# Altium schematic sheet biolab_rev2.SchDoc
size A; SheetNumber: 1; SheetTotal: 1
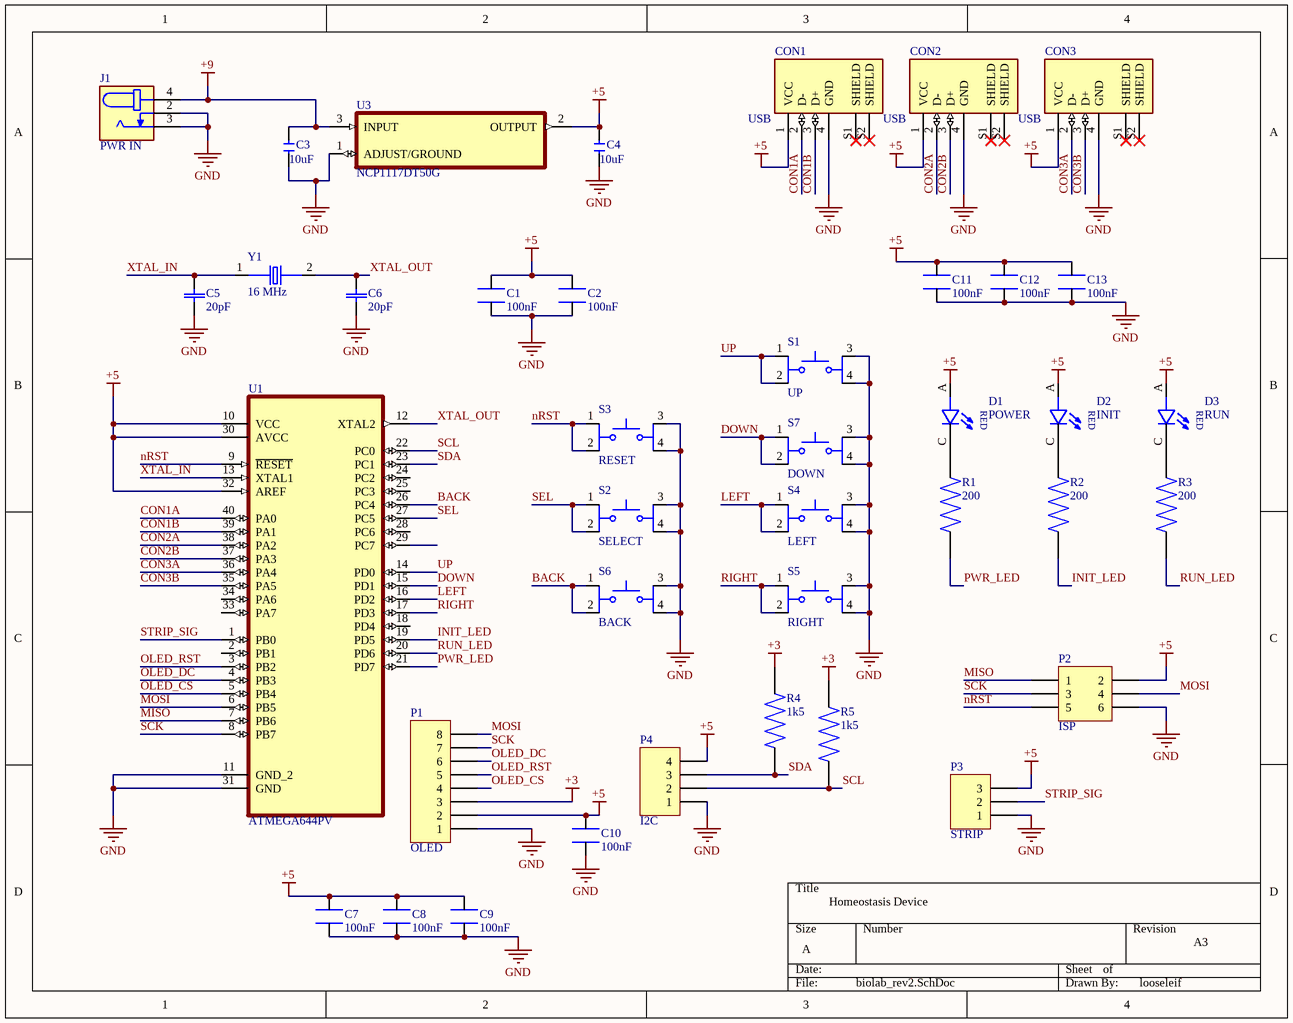
[diagram p0: biolab_rev2.SchDoc]

## Parts
C1  100nF  [WCAP-CSST_885382206004]
C2  100nF  [WCAP-CSST_885382206004]
C3  10uF  [C0603]
C4  10uF  [C0603]
C5  20pF  [CAPC1608X85N]
C6  20pF  [CAPC1608X85N]
C7  100nF  [WCAP-CSST_885382206004]
C8  100nF  [WCAP-CSST_885382206004]
C9  100nF  [WCAP-CSST_885382206004]
C10  100nF  [WCAP-CSST_885382206004]
C11  100nF  [WCAP-CSST_885382206004]
C12  100nF  [WCAP-CSST_885382206004]
C13  100nF  [WCAP-CSST_885382206004]
CON1  USB  [GCT_USB1130-15-A_REVA]
CON2  USB  [GCT_USB1130-15-A_REVA]
CON3  USB  [GCT_USB1130-15-A_REVA]
D1  POWER  [LED_7012X1]
D2  INIT  [LED_7012X1]
D3  RUN  [LED_7012X1]
J1  PWR IN  [NINIGI_DC-005]
P1  OLED  [HDR1X8]
P2  ISP  [HDR2X3]
P3  STRIP  [HDR1X3H]
P4  I2C  [HDR1X4H]
R1  200  [RESC1608X55N]
R2  200  [RESC1608X55N]
R3  200  [RESC1608X55N]
R4  1k5  [RESC1508X55N]
R5  1k5  [RESC1508X55N]
S1  UP  [SW_TL3301AF160QG]
S2  SELECT  [SW_TL3301AF160QG]
S3  RESET  [SW_TL3301AF160QG]
S4  LEFT  [SW_TL3301AF160QG]
S5  RIGHT  [SW_TL3301AF160QG]
S6  BACK  [SW_TL3301AF160QG]
S7  DOWN  [SW_TL3301AF160QG]
U1  ATMEGA644PV  [DIP254P1524X483-40]
U3  NCP1117DT50G  [DPAK229P990X238-4N]
Y1  16 MHz  [XTAL_FOXSDLF/160-20]

## Nets
+3: P1.3 R4.2 R5.2
+5: C1.2 C2.2 C4.2 C7.2 C8.2 C9.2 C10.2 C11.2 C12.2 C13.2 CON1.1(VCC) CON2.1(VCC) CON3.1(VCC) D1.A D2.A D3.A P1.2 P2.2 P3.3 P4.4 U1.10(VCC) U1.30(AVCC) U1.32(AREF) U3.2(OUTPUT)
+9: C3.2 J1.4 U3.3(INPUT)
GND: C1.1 C2.1 C3.1 C4.1 C5.1(C1) C6.1(C1) C7.1 C8.1 C9.1 C10.1 C11.1 C12.1 C13.1 CON1.4(GND) CON2.4(GND) CON3.4(GND) J1.2 J1.3 P1.1 P2.6 P3.1 P4.1 S1.3 S1.4 S2.3 S2.4 S3.3 S3.4 S4.3 S4.4 S5.3 S5.4 S6.3 S6.4 S7.3 S7.4 U1.11(GND_2) U1.31(GND) U3.1(ADJUST/GROUND)
BACK: S6.1 S6.2 U1.26(PC4)
CON1A: CON1.2(D-) U1.40(PA0)
CON1B: CON1.3(D+) U1.39(PA1)
CON2A: CON2.2(D-) U1.38(PA2)
CON2B: CON2.3(D+) U1.37(PA3)
CON3A: CON3.2(D-) U1.36(PA4)
CON3B: CON3.3(D+) U1.35(PA5)
DOWN: S7.1 S7.2 U1.15(PD1)
INIT_LED: R2.1 U1.19(PD5)
LEFT: S4.1 S4.2 U1.16(PD2)
MISO: P2.1 U1.7(PB6)
MOSI: P1.8 P2.4 U1.6(PB5)
nRST: P2.5 S3.1 S3.2 U1.9(~{RESET})
OLED_CS: P1.4 U1.5(PB4)
OLED_DC: P1.6 U1.4(PB3)
OLED_RST: P1.5 U1.3(PB2)
PWR_LED: R1.1 U1.21(PD7)
RIGHT: S5.1 S5.2 U1.17(PD3)
RUN_LED: R3.1 U1.20(PD6)
SCK: P1.7 P2.3 U1.8(PB7)
SCL: P4.2 R5.1 U1.22(PC0)
SDA: P4.3 R4.1 U1.23(PC1)
SEL: S2.1 S2.2 U1.27(PC5)
STRIP_SIG: P3.2 U1.1(PB0)
UP: S1.1 S1.2 U1.14(PD0)
XTAL_IN: C5.2(C2) U1.13(XTAL1) Y1.1
XTAL_OUT: C6.2(C2) U1.12(XTAL2) Y1.2
NetD1_C: D1.C R1.2
NetD2_C: D2.C R2.2
NetD3_C: D3.C R3.2

Not connected (* = marked no-connect by the designer): CON1 S1(SHIELD)* S2(SHIELD)*; CON2 S1(SHIELD)* S2(SHIELD)*; CON3 S1(SHIELD)* S2(SHIELD)*; U1 2(PB1) 18(PD4) 24(PC2) 25(PC3) 28(PC6) 29(PC7) 33(PA7) 34(PA6)

## Notes on the sheet
- Homeostasis Device
- A3
- looseleif
- (in symbol 7012X1) RED

## Library data of the parts
C1 C2 C7-C13 = 885382206004: <b> WCAP-CSST Soft Termination MLCC <br> <br> <br><b>Characteristics </b><br> </b><br>Multilayer ceramic chip capacitors <br>Recommended soldering: Reflow <br>Operating temperature: -55 Â°C up to +125 Â°C <br>Capacitance range: 220 pF - 2.2 ÂµF <br>Rated voltage: 16 V(DC) up to 2 kV(DC) <br>Size: 0603, 0805, 1206 and 1210 <br>High absorbtion of mechanical stress   <br> <br> <br><b>Applications </b><br> <br>Application with high mechanical stress <br>Power supply <br>Lighting  <br> <br> <br><a href="https://katalog.we-online.de/media/images/v2/Family_WCAP-CSST.jpg" title="Enlarge picture"> <img src="https://katalog.we-online.de/media/images/v2/Family_WCAP-CSST.jpg" width="320"></a><p> Details see: <a href="https://katalog.we-online.de/en/pbs/WCAP-CSST#vs_ct:1">https://katalog.we-online.de/en/pbs/WCAP-CSST#vs_ct:1<br> <br></a><p>Created By Yingchun,Shan 2018-11-14 <br><br>20178(C) Wurth Elektronik; MF: {'manufacturer': u'Wurth Electronics Inc'}; Package: None; MP: 885382206004; Value: *; Availability: Unavailable; Price: None
C3 C4 = CERAMIC-10UF-10V-10%-X5R(0603): 302010103; MF: {'manufacturer': u'Yageo'}; Price: None; Value: *; MP: CERAMIC-10UF-10V-10%-X5R(0603); Package: None; Availability: Unavailable
C5 C6 = C0603C200J5GACTU: CAPACITOR, 0603; MF: {'manufacturer': u'KEMET'}; Price: None; Value: *; Package: None; MP: C0603C200J5GACTU; Availability: Unavailable
CON1-CON3 = USB1130-15-A_REVA: MF: {'manufacturer': u'Global Connector Technology'}; MP: USB1130-15-A_REVA; Value: *; Price: None; Package: None; Availability: Unavailable
D1-D3 = 7012X1: Red LED Indication - Discrete 1.7V 0805 (2012 Metric); MF: {'manufacturer': u'Visual'}; Availability: Unavailable; Value: *; Package: None; MP: 7012X1; Price: None
J1 = DC-005: DC Jack; MF: {'manufacturer': u'Best Inc.'}; Package: None; Availability: Unavailable; Price: None; MP: DC-005; Value: *
P1 = Header 8: Header, 8-Pin; LatestRevisionDate: 17-Jul-2002; LatestRevisionNote: Re-released for DXP Platform.; Publisher: Altium Limited
P2 = Header 3X2: Header, 3-Pin, Dual row; LatestRevisionDate: 17-Jul-2002; LatestRevisionNote: Re-released for DXP Platform.; Publisher: Altium Limited
P3 = Header 3H: Header, 3-Pin, Right Angle; LatestRevisionDate: 17-Jul-2002; LatestRevisionNote: Re-released for DXP Platform.; Publisher: Altium Limited
P4 = Header 4H: Header, 4-Pin, Right Angle; LatestRevisionDate: 17-Jul-2002; LatestRevisionNote: Re-released for DXP Platform.; Publisher: Altium Limited
R1-R3 = SR0603JR-07200RL: MF: {'manufacturer': u'Yageo'}; Package: None; MP: SR0603JR-07200RL; Value: *; Availability: Unavailable; Price: None
R4 R5 = TNPW06031K50BXEN: MF: {'manufacturer': u'Vishay'}; Package: None; MP: TNPW06031K50BXEN; Value: *; Availability: Unavailable; Price: None
S1-S7 = TL3301AF160QG: MF: {'manufacturer': u'E-Switch'}; Price: None; MP: TL3301AF160QG; Availability: Unavailable; Value: *; Package: None
U1 = ATMEGA644PV-10PU: 8-bit Microcontroller with In-System Programmable  Flash; MF: {'manufacturer': u'Microchip Technology'}; Availability: Unavailable; MP: ATMEGA644PV-10PU; Value: *; Price: None; Package: None
U3 = NCP1117DT50G: MF: {'manufacturer': u'ON Semiconductor'}; Price: None; Value: *; Package: None; MP: NCP1117DT50G; Availability: Unavailable
Y1 = FOXSDLF/160-20: Crystal 16MHz 20pF 2-Pin HC-49/SD; MF: {'manufacturer': u'Fox Electronics'}; Value: *; Availability: Unavailable; Package: None; MP: FOXSDLF/160-20; Price: None